# EAGLE design V-00689-00 (EAGLE 7.2.0)
AUTHOR: M. Petrilak; VERSION: 01
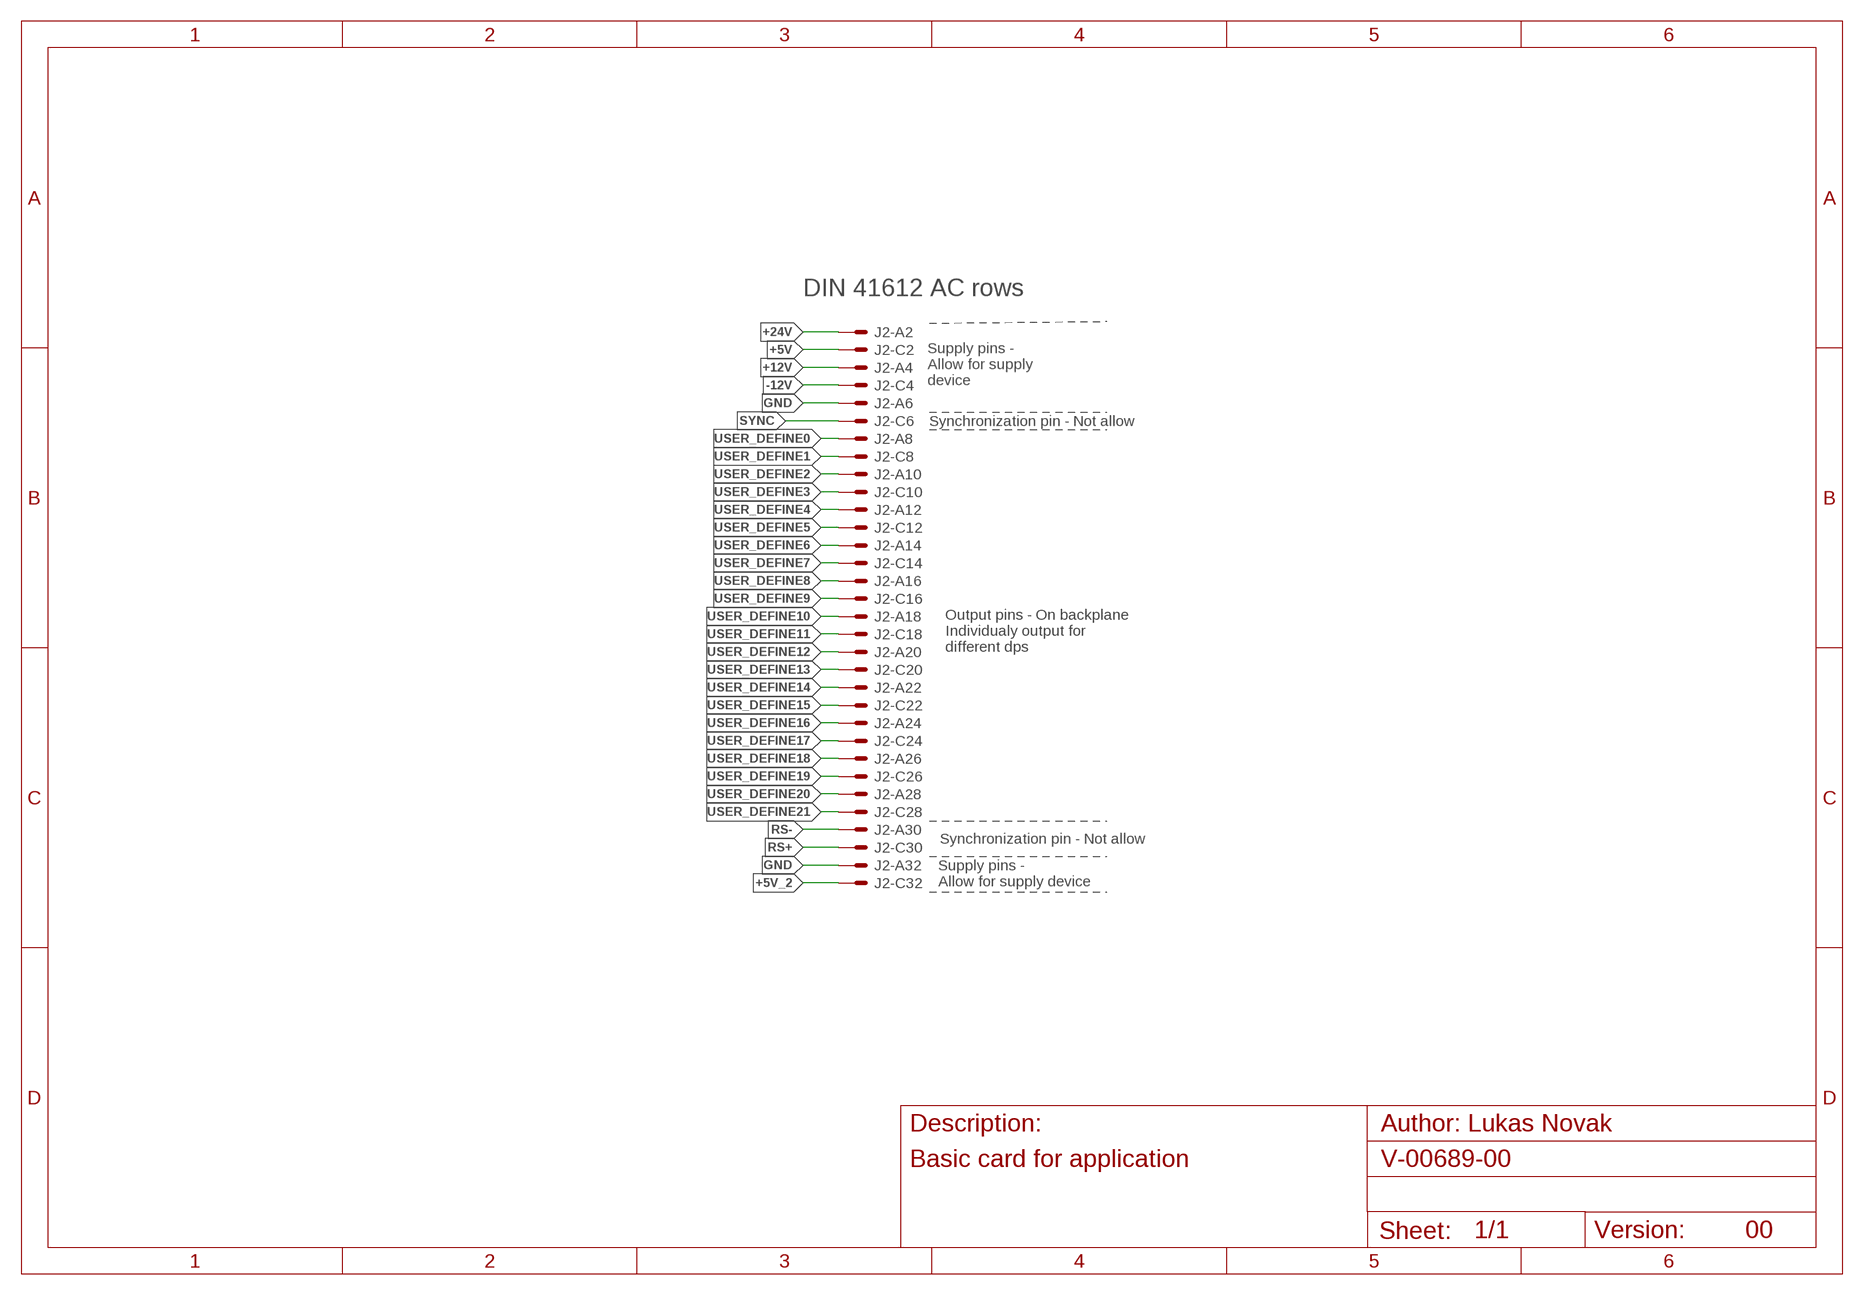
[diagram p0: schematic, sheet 1]

## Parts
J2  VG32SP  [VG32P]

## Nets
+5V: J2.C2
+5V_2: J2.C32
+12V: J2.A4
+24V: J2.A2
-12V: J2.C4
GND: J2.A6 J2.A32
RS+: J2.C30
RS-: J2.A30
SYNC: J2.C6
USER_DEFINE0: J2.A8
USER_DEFINE1: J2.C8
USER_DEFINE2: J2.A10
USER_DEFINE3: J2.C10
USER_DEFINE4: J2.A12
USER_DEFINE5: J2.C12
USER_DEFINE6: J2.A14
USER_DEFINE7: J2.C14
USER_DEFINE8: J2.A16
USER_DEFINE9: J2.C16
USER_DEFINE10: J2.A18
USER_DEFINE11: J2.C18
USER_DEFINE12: J2.A20
USER_DEFINE13: J2.C20
USER_DEFINE14: J2.A22
USER_DEFINE15: J2.C22
USER_DEFINE16: J2.A24
USER_DEFINE17: J2.C24
USER_DEFINE18: J2.A26
USER_DEFINE19: J2.C26
USER_DEFINE20: J2.A28
USER_DEFINE21: J2.C28

## Notes on the sheet
- DIN 41612 AC rows
- Supply pins -
  Allow for supply
  device
- Synchronization pin - Not allow
- Output pins - On backplane
  Individualy output for
  different dps
- Synchronization pin - Not allow
- Supply pins -
  Allow for supply device
- Basic card for application
- 00

## Library data of the parts
J2 = 19inch:VG32S: PCB EUROCARD, 32-pin type C/AC, 5.08 mm

## Board
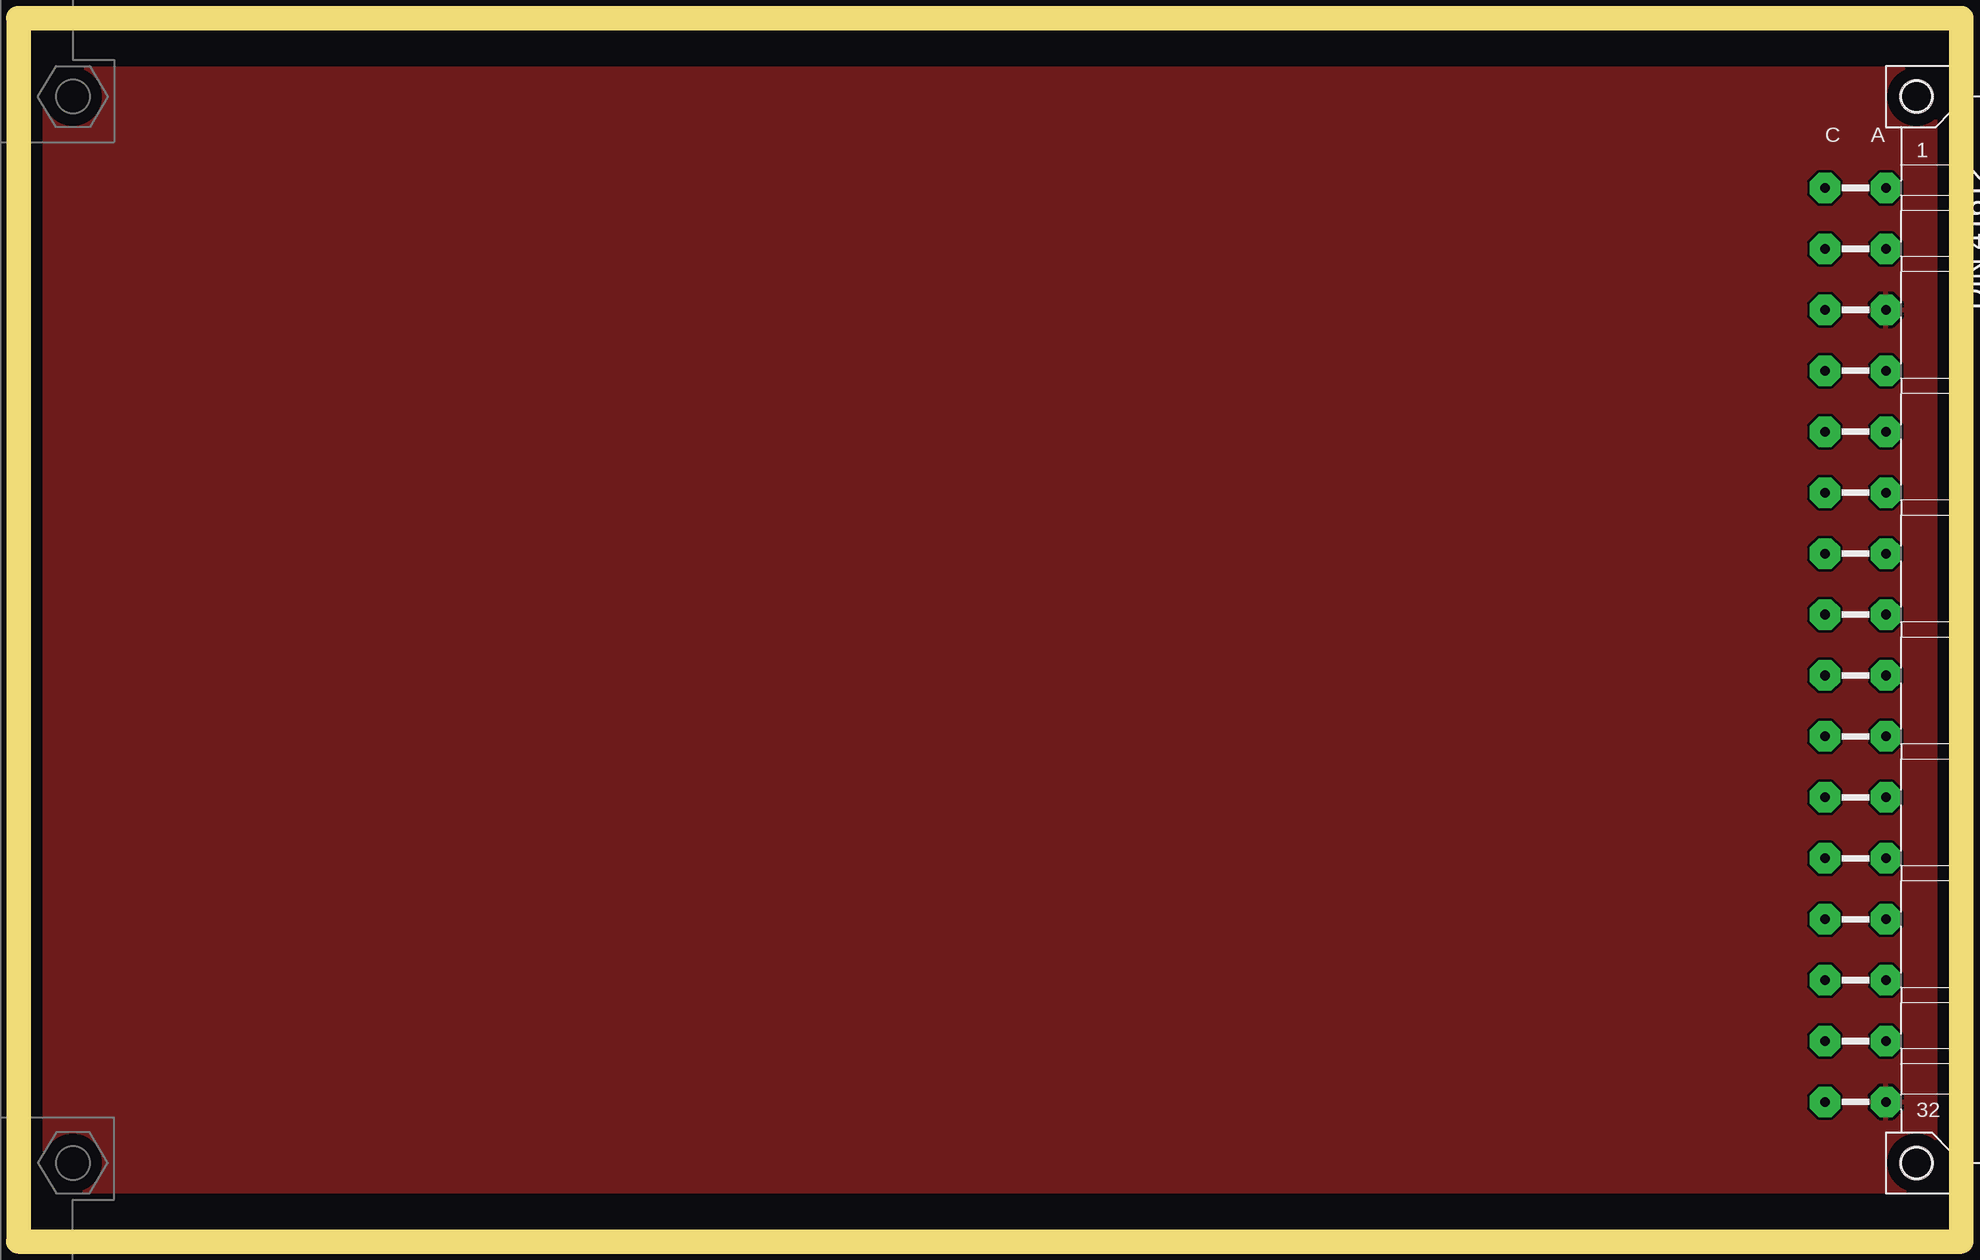
[diagram p1: board, top side]
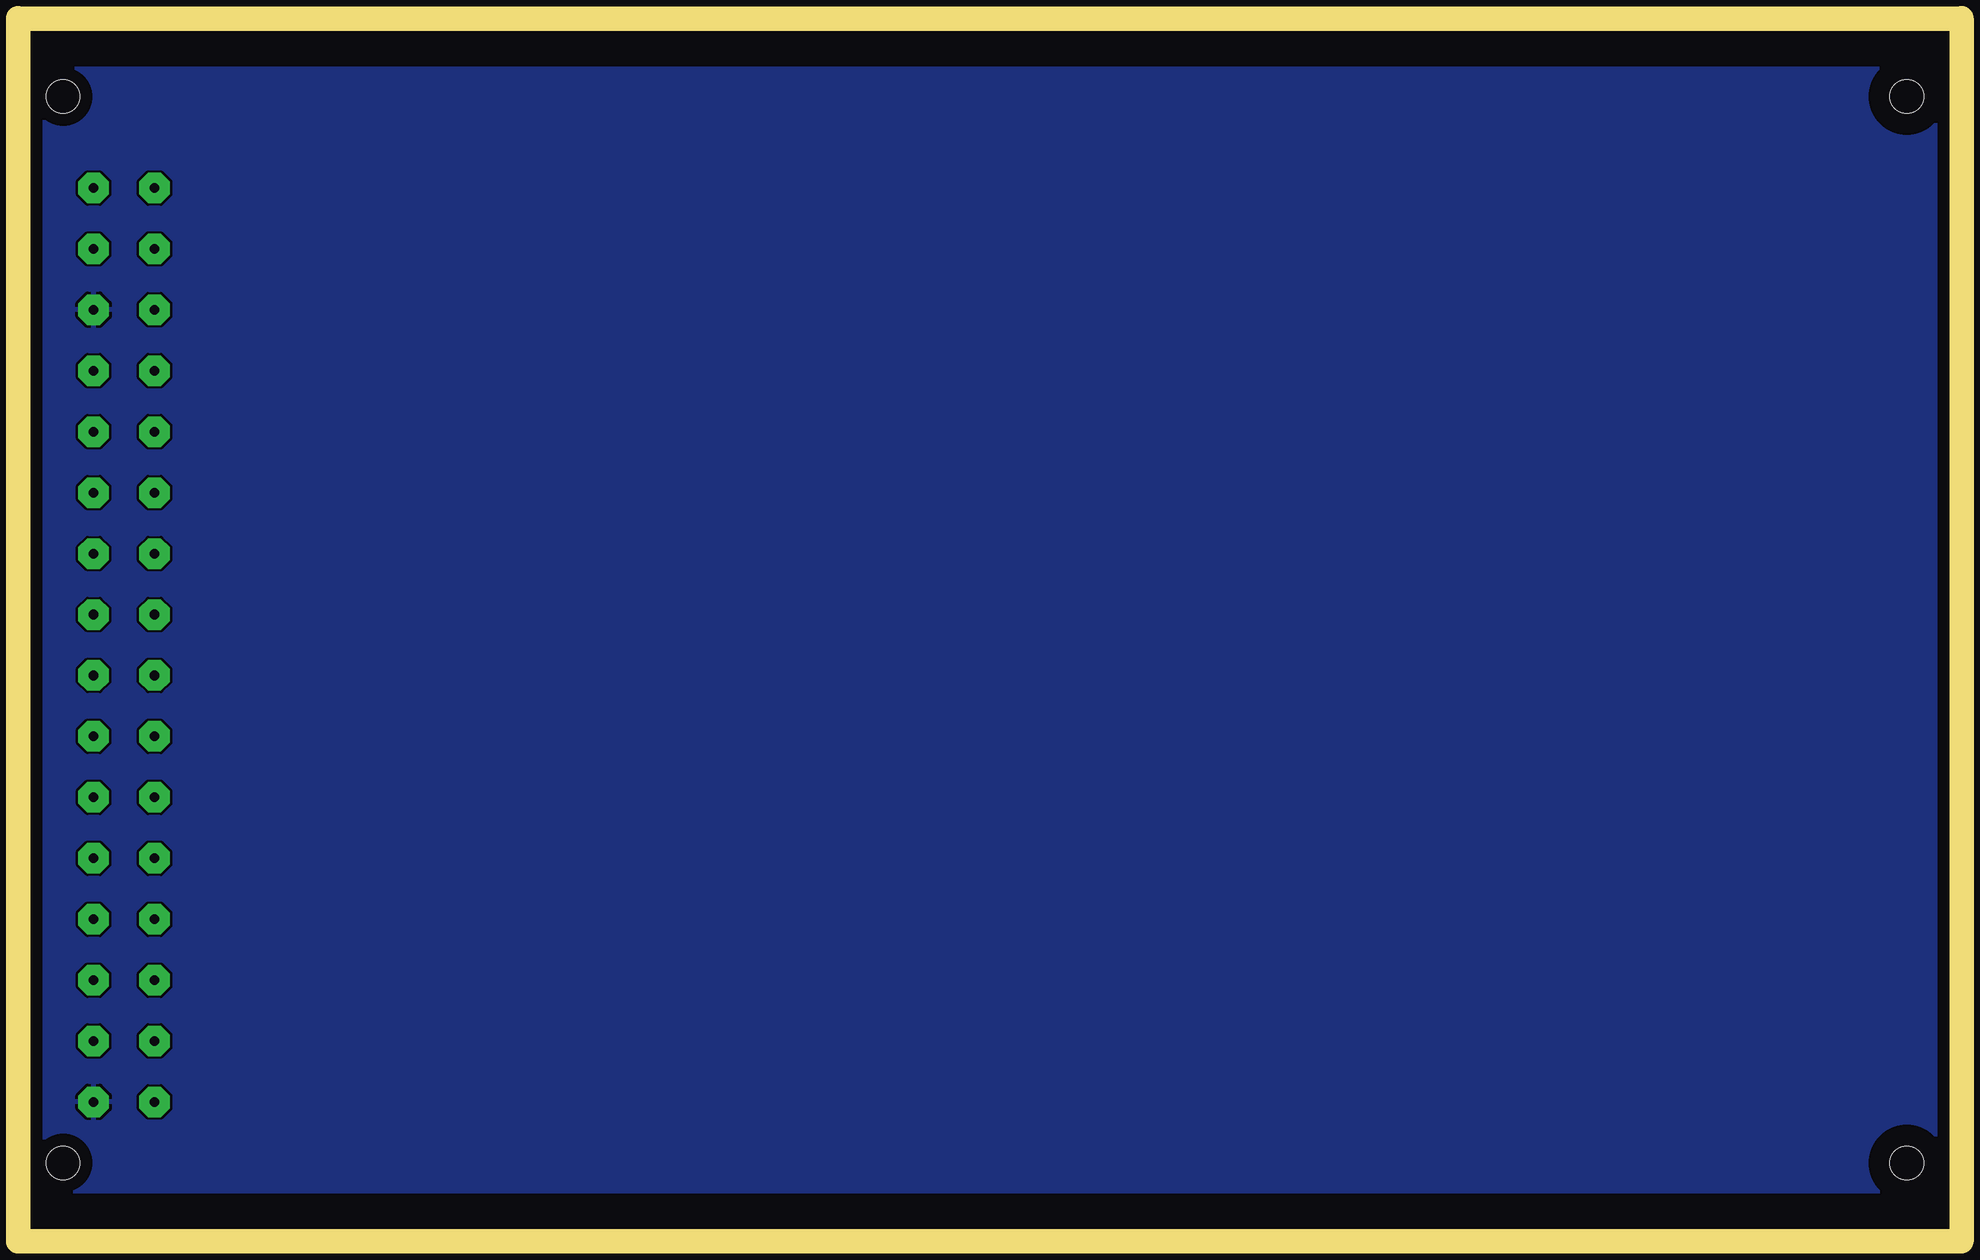
[diagram p2: board, bottom side, seen from below]

Size 160 x 100 mm. Coordinates in mm from the lower left corner, seen from the top.
Copper layers (1*16): Top 0.035mm / dielectric 1.5mm / Bottom 0.035mm
Design rules "default": minimum track width 10mil, minimum drill 24mil, track to track 8mil, track to pad 8mil, pad to pad 8mil, via to via 8mil, smd to smd 8mil, copper to edge 40mil, drill to drill 8mil, minimum pad ring 10mil, minimum via ring 8mil, stop-mask expansion 4mil, vias tented up to drill 0mil, thermal gap 10mil

### Footprints (pad centres in the part's own frame; a part is rotated, then mirrored left to right if it is on the bottom)
VG32P = drill 0.8 pad 2.54 octagon: A2 154.7,36.83; A4 154.7,31.75; A6 154.7,26.67; A8 154.7,21.59; A10 154.7,16.51; A12 154.7,11.43; A14 154.7,6.35; A16 154.7,1.27; A18 154.7,-3.81; A20 154.7,-8.89; A22 154.7,-13.97; A24 154.7,-19.05; A26 154.7,-24.13; A28 154.7,-29.21; A30 154.7,-34.29; A32 154.7,-39.37; C2 149.62,36.83; C4 149.62,31.75; C6 149.62,26.67; C8 149.62,21.59; C10 149.62,16.51; C12 149.62,11.43; C14 149.62,6.35; C16 149.62,1.27; C18 149.62,-3.81; C20 149.62,-8.89; C22 149.62,-13.97; C24 149.62,-19.05; C26 149.62,-24.13; C28 149.62,-29.21; C30 149.62,-34.29; C32 149.62,-39.37 | hole 2.794: 3.57,44.45; 3.57,-44.45; 157.24,44.45; 157.24,-44.45

### Placement (x,y rotation side)
J2  0,50 0 top
U$1  [A4L-LOC]  -52,-41.8 0 top  (outside the outline)

### Tracks (layer width: path | path; a pad name or v marks a point on that pad's centre or on a via)
GND
  pour Top: 0,0 160,0 160,100 0,100
  pour Bottom: 0,0 160,0 160,100 0,100

### Text on the board
centerDrill: 00